# EasyEDA schematic SCH_AC-powered-ESP8266-RelayController_2023-11-18.json
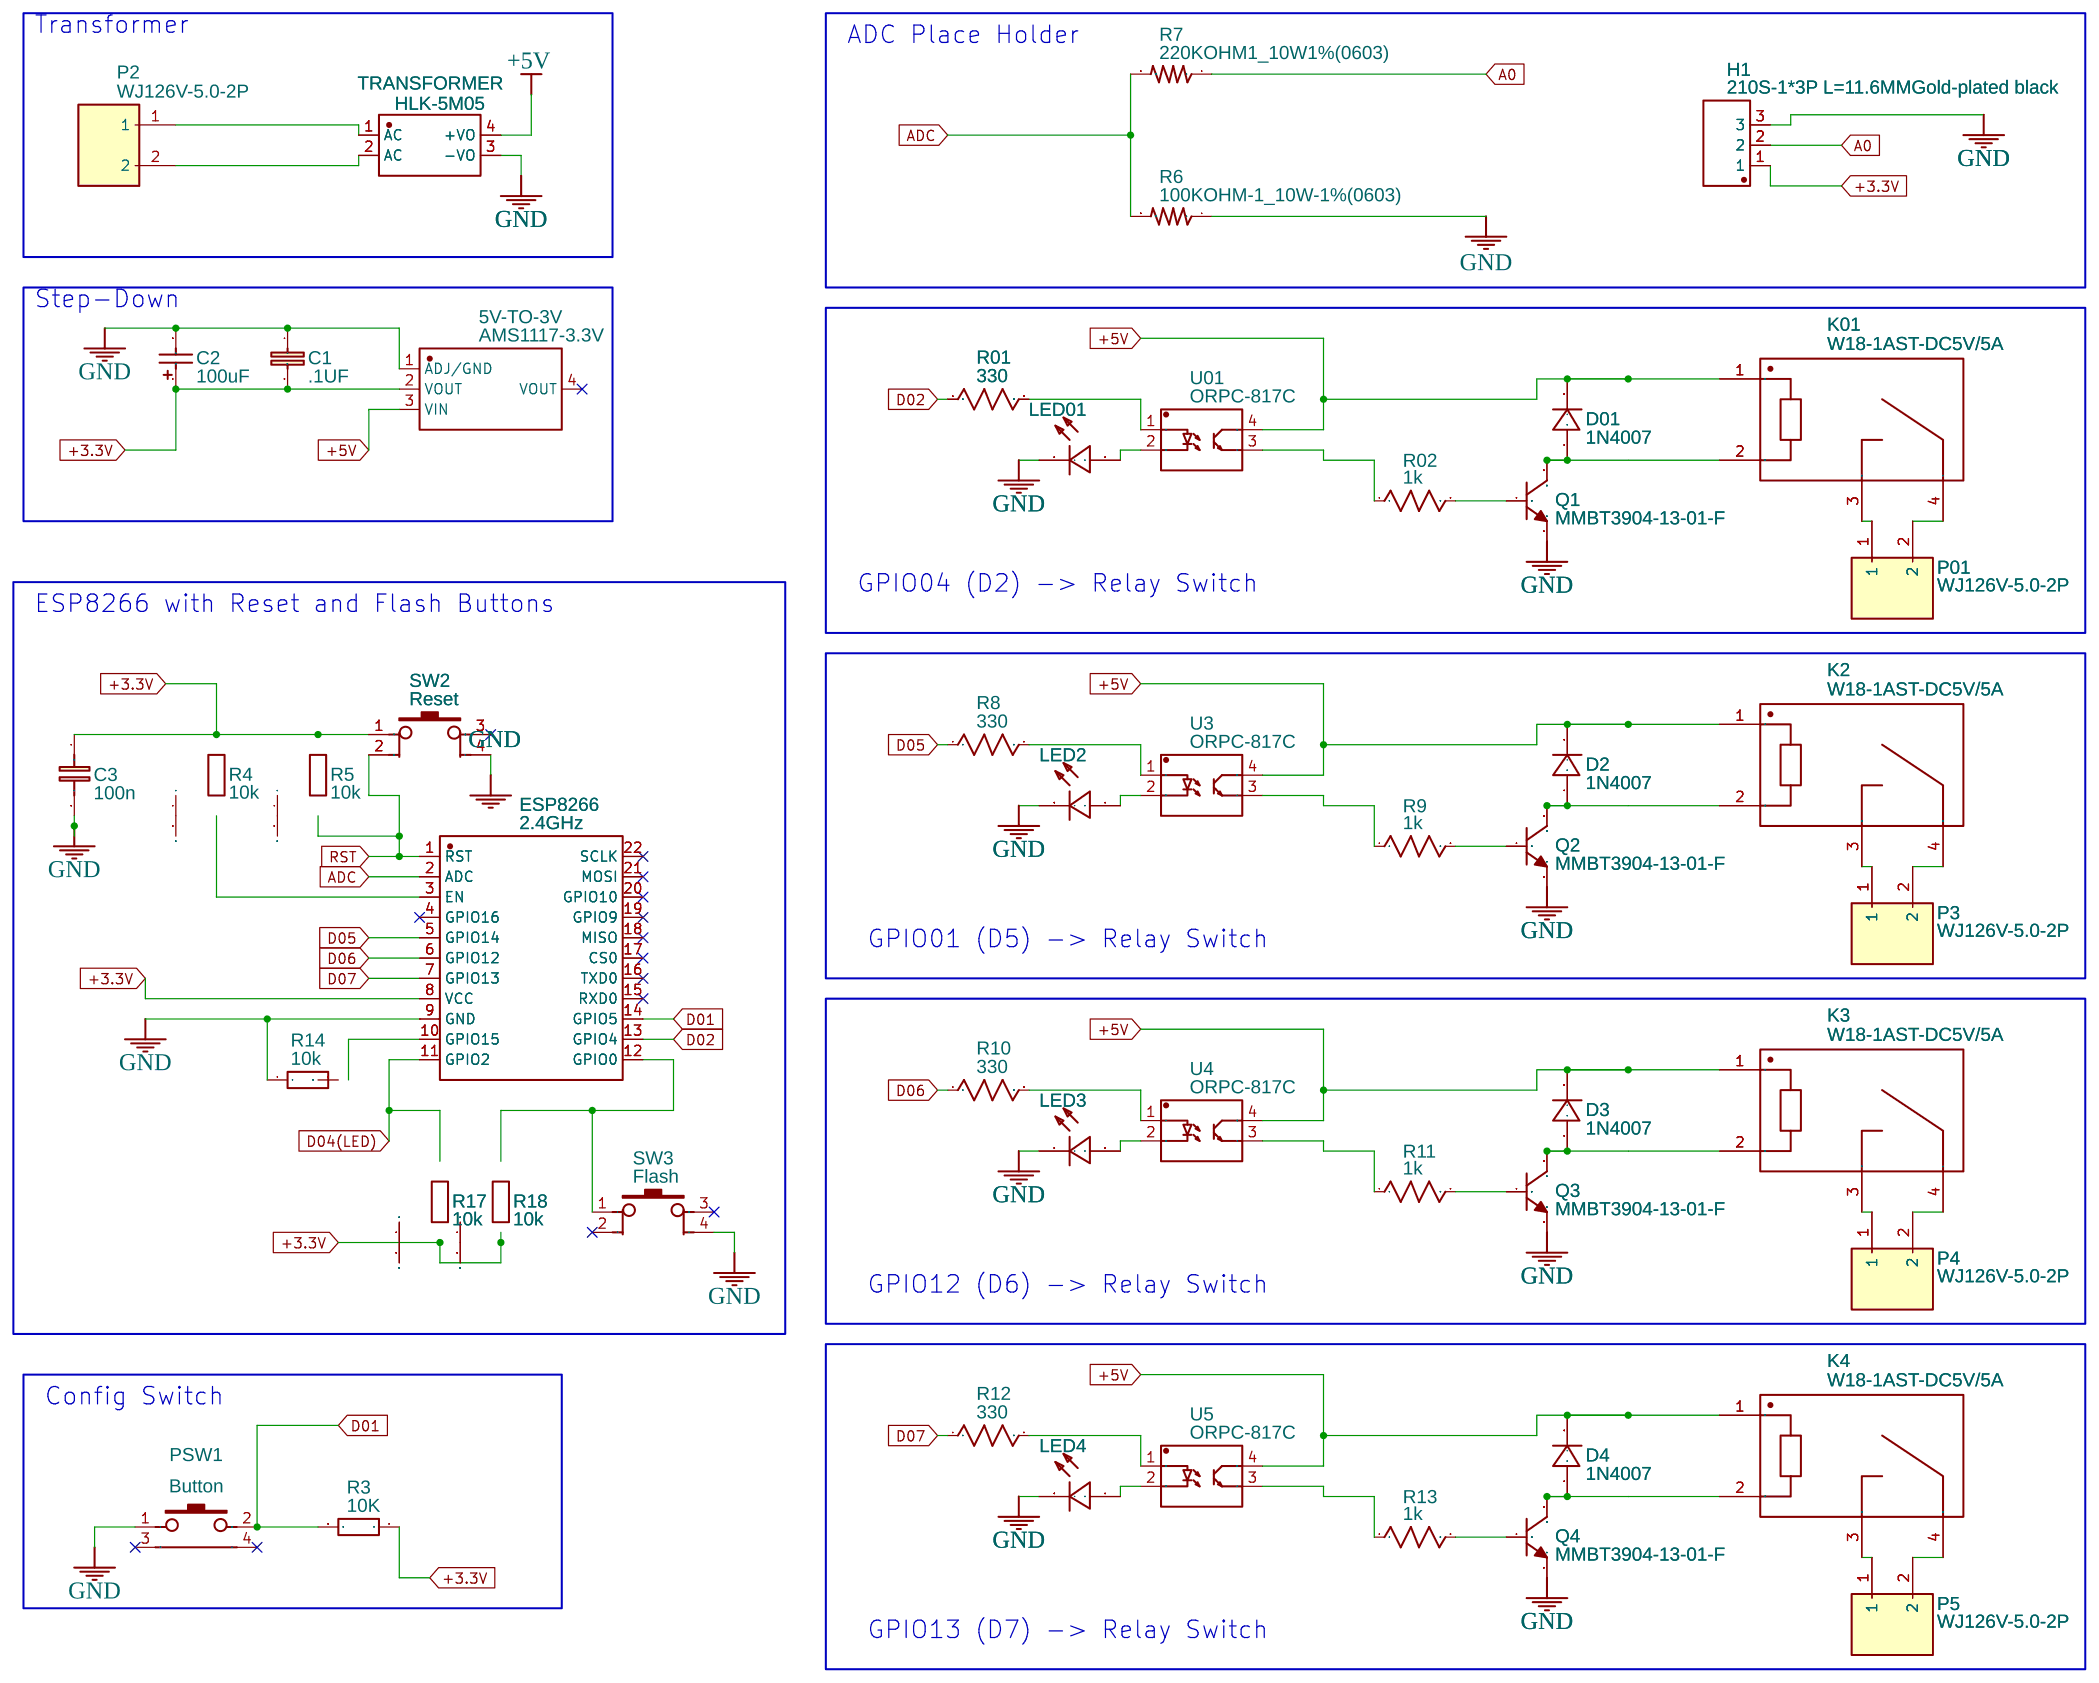
[diagram p0: schematic sheet]

## Parts
5V-TO-3V  AMS1117-3.3V  [SOT-223-4_L6.5-W3.5-P2.30-LS7.0-BR]
C1  .1UF  [0402-CAP]
C2  100uF  [CAP-SMD_L3.5-W2.8]
C3  100n  [C1206]
D01  1N4007  [M7]
D2  1N4007  [M7]
D3  1N4007  [M7]
D4  1N4007  [M7]
ESP8266  2.4GHz  [WIFIM-SMD_ESP-12F-ESP8266MOD]
H1  210S-1*3P L=11.6MMGold-plated black  [DIP-1X3P-2.54MM-M]
K01  W18-1AST-DC5V/5A  [RELAY-TH_4P-L20.5-W7.2-P4.70]
K2  W18-1AST-DC5V/5A  [RELAY-TH_4P-L20.5-W7.2-P4.70]
K3  W18-1AST-DC5V/5A  [RELAY-TH_4P-L20.5-W7.2-P4.70]
K4  W18-1AST-DC5V/5A  [RELAY-TH_4P-L20.5-W7.2-P4.70]
LED01  LED-5MM  [LED0603-R-RD_RED]
LED2  LED-5MM  [LED0603-R-RD_RED]
LED3  LED-5MM  [LED0603-R-RD_RED]
LED4  LED-5MM  [LED0603-R-RD_RED]
P01  WJ126V-5.0-2P  [CONN-TH_WJ126V-5.0-2P]
P2  WJ126V-5.0-2P  [CONN-TH_WJ126V-5.0-2P]
P3  WJ126V-5.0-2P  [CONN-TH_WJ126V-5.0-2P]
P4  WJ126V-5.0-2P  [CONN-TH_WJ126V-5.0-2P]
P5  WJ126V-5.0-2P  [CONN-TH_WJ126V-5.0-2P]
PSW1  Button  [SW-TH_BBJ-C71833]
Q1  MMBT3904-13-01-F  [SOT-23-3_L2.9-W1.3-P1.90-LS2.4-BR]
Q2  MMBT3904-13-01-F  [SOT-23-3_L2.9-W1.3-P1.90-LS2.4-BR]
Q3  MMBT3904-13-01-F  [SOT-23-3_L2.9-W1.3-P1.90-LS2.4-BR]
Q4  MMBT3904-13-01-F  [SOT-23-3_L2.9-W1.3-P1.90-LS2.4-BR]
R01  330  [R0603]
R02  1k  [R0603]
R3  10K  [R0603]
R4  10k  [R0805]
R5  10k  [R0805]
R6  100KOHM-1_10W-1%(0603)  [0603-RES]
R7  220KOHM1_10W1%(0603)  [0603-RES]
R8  330  [R0603]
R9  1k  [R0603]
R10  330  [R0603]
R11  1k  [R0603]
R12  330  [R0603]
R13  1k  [R0603]
R14  10k  [R0805]
R17  10k  [R0805]
R18  10k  [R0805]
SW2  Reset  [SW-TH_4PIN-L6.00-W6.00]
SW3  Flash  [SW-TH_4PIN-L6.00-W6.00]
TRANSFORMER  HLK-5M05  [PWRM-TH_HLK-5M05]
U01  ORPC-817C  [DIP-4_L6.4-W4.6-P2.54-LS7.6-BL]
U3  ORPC-817C  [DIP-4_L6.4-W4.6-P2.54-LS7.6-BL]
U4  ORPC-817C  [DIP-4_L6.4-W4.6-P2.54-LS7.6-BL]
U5  ORPC-817C  [DIP-4_L6.4-W4.6-P2.54-LS7.6-BL]

## Library data of the parts
5V-TO-3V = AMS1117-3.3V: Contributor: LCSC; Supplier: LCSC; Supplier Part: C2688239; Manufacturer: WPMtek(维攀微); JLCPCB Part Class: Extended Part; link: https://lcsc.com/eda_search?q=C2688239&%26type=1&ref=editor
C1 = .1UF-CERCAP-08604: .1uF ceramic SMT; Contributor: SparkFun
C2 = TAJB107K006RNJ: Supplier: LCSC; Manufacturer: AVX; LCSC Assembly: Yes; Supplier Part: C16133; SMT Type: Basic
C3 = Capacitor: Manufacturer Part: ?
D01-D4 = -: Supplier: LCSC; Manufacturer: ON; Manufacturer Part: 1N4007RLG; image: //image.lceda.cn/szlcsc/C53568.jpg; Supplier Part: C53568
ESP8266 = ESP-12F(ESP8266MOD): Supplier: LCSC; Manufacturer: Ai-Thinker(安信可); Supplier Part: C82891; JLCPCB Part Class: Extended Part; link: https://lcsc.com/eda_search?q=C82891&%26type=1&ref=editor
H1 = 210S-1*3P L=11.6MMGold-plated black: Supplier: LCSC; Manufacturer: Ckmtw; Contributor: LCSC; Supplier Part: C124376; LCSC Assembly: Yes; SMT Type: Extend; JLCPCB Part Class: Extended Part
K01-K4 = W18-1AST-DC5V/5A: Supplier: LCSC; Supplier Part: C467041; Manufacturer: Zhejiang Fanhar; Contributor: LCSC; JLCPCB Part Class: Extended Part
LED01-LED4 = -: Supplier: LCSC; Manufacturer: EVERLIGHT; Manufacturer Part: 5AR2ST10; Supplier Part: C52721
P01-P5 = WJ126V-5.0-2P: Supplier: LCSC; Manufacturer: ReliaPro; Supplier Part: C8404; JLCPCB Part Class: Extended Part
PSW1 = Button-6x6x8-Right-Angle: Supplier Part: C71833; Supplier: LCSC; Manufacturer: BBJ; Manufacturer Part: 6*6*8Plastic head,260G, 0.25mm,Side bracket
Q1-Q4 = MMBT3904-13-01-F: Contributor: LCSC; Supplier: LCSC; Supplier Part: C526674; Manufacturer: DIODES(美台); JLCPCB Part Class: Extended Part; link: https://lcsc.com/eda_search?q=C526674&%26type=1&ref=editor
R01 R02 R8-R13 = Res_AXIAL-0.4(1/4W)_US: Manufacturer Part: ?
R3 = AC0603FR-0710KL: Supplier: LCSC; Manufacturer: YAGEO; Supplier Part: C116677; JLCPCB Part Class: Extended Part
R4 R5 R14 R17 R18 = Resistor: Manufacturer Part: ?
R6 = 100KOHM-1_10W-1%(0603): RES-07828; Contributor: SparkFun
R7 = 220KOHM1_10W1%(0603): RES-08969; Contributor: SparkFun
SW2 SW3 = 6*6*13: Supplier Part: C69940; Supplier: LCSC; Manufacturer: ReliaPro
TRANSFORMER = HLK-5M05: Contributor: LCSC; Supplier: LCSC; Supplier Part: C209907; Manufacturer: HI-LINK(海凌科); JLCPCB Part Class: Extended Part; link: https://lcsc.com/eda_search?q=C209907&%26type=1&ref=editor
U01 U3-U5 = ORPC-817C: Contributor: LCSC; Supplier: LCSC; Supplier Part: C231239; Manufacturer: Orient(奥伦德); JLCPCB Part Class: Extended Part; link: https://lcsc.com/eda_search?q=C231239&%26type=1&ref=editor

## Nets
+3.3V: 5V-TO-3V.2(VOUT) C1.2 C2.1 C3.1 ESP8266.8(VCC) H1.1 R3.1 R4.2 R5.2 R17.1 R18.1 SW2.1
+5V: 5V-TO-3V.3(VIN) D01.2(-) D2.2(-) D3.2(-) D4.2(-) K01.1 K2.1 K3.1 K4.1 TRANSFORMER.4(+VO) U01.4(C) U3.4(C) U4.4(C) U5.4(C)
GND: 5V-TO-3V.1(ADJ/GND) C1.1 C2.2 C3.2 ESP8266.9(GND) H1.3 LED01.2(-) LED2.2(-) LED3.2(-) LED4.2(-) PSW1.1 Q1.2(E) Q2.2(E) Q3.2(E) Q4.2(E) R6.1 R14.1 SW2.4 SW3.4 TRANSFORMER.3(-VO)
A0: H1.2 R7.1
ADC: ESP8266.2(ADC) R6.2 R7.2
D01: ESP8266.14(GPIO5) PSW1.2 R3.2
D02: ESP8266.13(GPIO4) R01.1
D04(LED): ESP8266.11(GPIO2) R17.2
D05: ESP8266.5(GPIO14) R8.1
D06: ESP8266.6(GPIO12) R10.1
D07: ESP8266.7(GPIO13) R12.1
RST: ESP8266.1(RST) R5.1 SW2.2
Net-(D01-1): D01.1(+) K01.2 Q1.3(C)
Net-(D2-1): D2.1(+) K2.2 Q2.3(C)
Net-(D3-1): D3.1(+) K3.2 Q3.3(C)
Net-(D4-1): D4.1(+) K4.2 Q4.3(C)
Net-(ESP8266-3): ESP8266.3(EN) R4.1
Net-(ESP8266-10): ESP8266.10(GPIO15) R14.2
Net-(ESP8266-12): ESP8266.12(GPIO0) R18.2 SW3.1
Net-(K01-3): K01.3 P01.1
Net-(K01-4): K01.4 P01.2
Net-(K2-3): K2.3 P3.1
Net-(K2-4): K2.4 P3.2
Net-(K3-3): K3.3 P4.1
Net-(K3-4): K3.4 P4.2
Net-(K4-3): K4.3 P5.1
Net-(K4-4): K4.4 P5.2
Net-(LED01-1): LED01.1(+) U01.2(C)
Net-(LED2-1): LED2.1(+) U3.2(C)
Net-(LED3-1): LED3.1(+) U4.2(C)
Net-(LED4-1): LED4.1(+) U5.2(C)
Net-(P2-1): P2.1 TRANSFORMER.1(AC)
Net-(P2-2): P2.2 TRANSFORMER.2(AC)
Net-(Q1-1): Q1.1(B) R02.2
Net-(Q2-1): Q2.1(B) R9.2
Net-(Q3-1): Q3.1(B) R11.2
Net-(Q4-1): Q4.1(B) R13.2
Net-(R01-2): R01.2 U01.1(A)
Net-(R02-1): R02.1 U01.3(E)
Net-(R8-2): R8.2 U3.1(A)
Net-(R9-1): R9.1 U3.3(E)
Net-(R10-2): R10.2 U4.1(A)
Net-(R11-1): R11.1 U4.3(E)
Net-(R12-2): R12.2 U5.1(A)
Net-(R13-1): R13.1 U5.3(E)

Not connected (* = marked no-connect by the designer): 5V-TO-3V 4(VOUT)*; ESP8266 4(GPIO16)* 15(RXD0)* 16(TXD0)* 17(CS0)* 18(MISO)* 19(GPIO9)* 20(GPIO10)* 21(MOSI)* 22(SCLK)*; PSW1 3* 4*; SW2 3*; SW3 2* 3*

## Notes on the sheet
- Transformer
- ADC Place Holder
- Step-Down
- GPIO04 (D2) -> Relay Switch
- ESP8266 with Reset and Flash Buttons
- GPIO01 (D5) -> Relay Switch
- GPIO12 (D6) -> Relay Switch
- Config Switch
- GPIO13 (D7) -> Relay Switch
